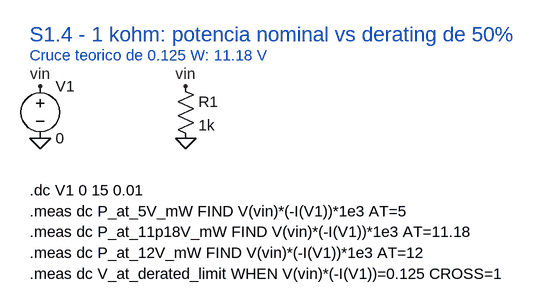
[diagram p0: schematic semana1_04_potencia_derating.asc]
semana1_04_potencia_derating.asc, the LTspice schematic file:
Version 4
SHEET 1 880 680
SYMBOL voltage 80 112 R0
SYMATTR InstName V1
SYMATTR Value 0
SYMBOL res 288 112 R0
SYMATTR InstName R1
SYMATTR Value 1k
FLAG 80 128 vin
FLAG 80 208 0
FLAG 304 128 vin
FLAG 304 208 0
TEXT 64 288 Left 2 !.dc V1 0 15 0.01
TEXT 64 320 Left 2 !.meas dc P_at_5V_mW FIND V(vin)*(-I(V1))*1e3 AT=5
TEXT 64 352 Left 2 !.meas dc P_at_11p18V_mW FIND V(vin)*(-I(V1))*1e3 AT=11.18
TEXT 64 384 Left 2 !.meas dc P_at_12V_mW FIND V(vin)*(-I(V1))*1e3 AT=12
TEXT 64 416 Left 2 !.meas dc V_at_derated_limit WHEN V(vin)*(-I(V1))=0.125 CROSS=1
TEXT 64 48 Left 3 ;S1.4 - 1 kohm: potencia nominal vs derating de 50%
TEXT 64 80 Left 2 ;Cruce teorico de 0.125 W: 11.18 V

The netlist it stands for:
* semana1_04_potencia_derating.asc
V1 vin 0 0
R1 vin 0 1k
.dc V1 0 15 0.01
.meas dc P_at_5V_mW FIND V(vin)*(-I(V1))*1e3 AT=5
.meas dc P_at_11p18V_mW FIND V(vin)*(-I(V1))*1e3 AT=11.18
.meas dc P_at_12V_mW FIND V(vin)*(-I(V1))*1e3 AT=12
.meas dc V_at_derated_limit WHEN V(vin)*(-I(V1))=0.125 CROSS=1
* S1.4 - 1 kohm: potencia nominal vs derating de 50%
* Cruce teorico de 0.125 W: 11.18 V
.backanno
.end